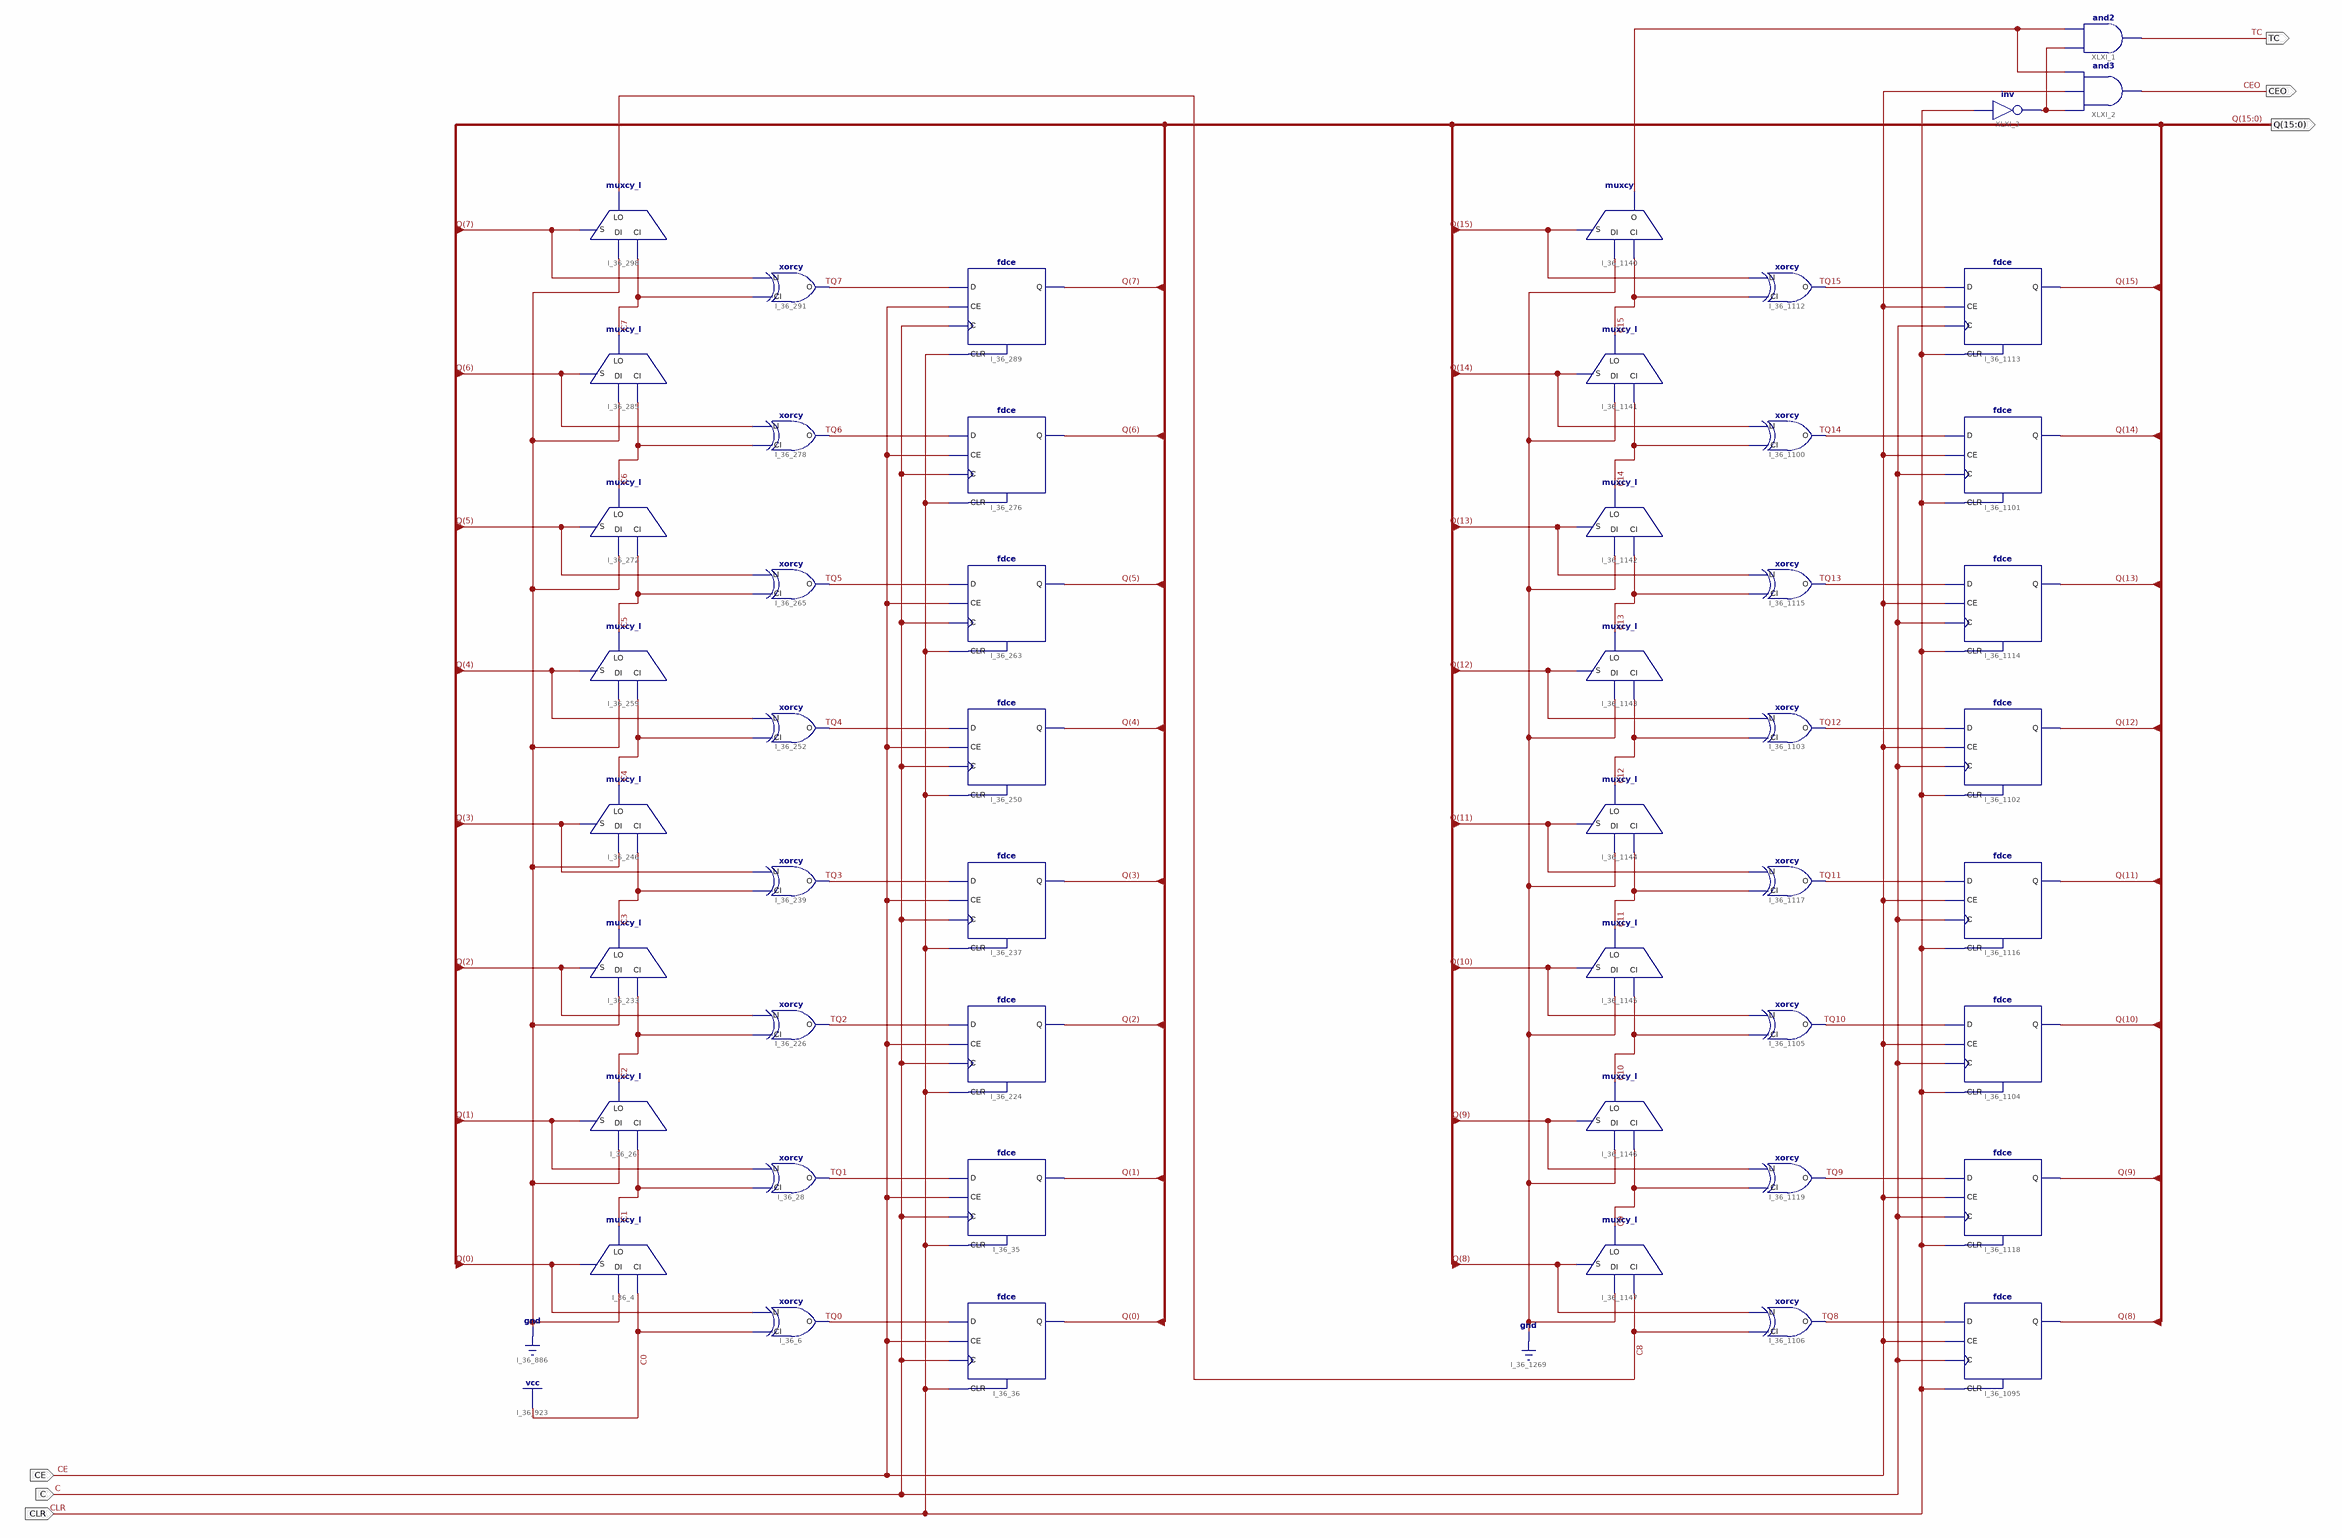
[diagram p0: schematic sheet 1]
// Xilinx ISE schematic Mycc16ce.sch (virtex4) as structural Verilog: 51 symbols, 6 ports
module Mycc16ce (
  input  CE,
  input  CLR,
  input  C,
  output CEO,
  output TC,
  output [15:0] Q
);

  wire C1, C2, C3, C4, C5, C6, C7, C8, C9, C10, C11, C12, C13, C14, C15, TC_1, TQ0, TQ1, TQ2, TQ3, TQ4, TQ5,
       TQ6, TQ7, TQ8, TQ9, TQ10, TQ11, TQ12, TQ13, TQ14, TQ15, XLXN_40;

  fdce #(.RLOC("X0Y2")) I_36_263 (.C(C), .CE(CE), .CLR(CLR), .D(TQ5), .Q(Q[5]));
  fdce #(.RLOC("X0Y0")) I_36_36 (.C(C), .CE(CE), .CLR(CLR), .D(TQ0), .Q(Q[0]));
  fdce #(.RLOC("X0Y0")) I_36_35 (.C(C), .CE(CE), .CLR(CLR), .D(TQ1), .Q(Q[1]));
  fdce #(.RLOC("X0Y7")) I_36_1101 (.C(C), .CE(CE), .CLR(CLR), .D(TQ14), .Q(Q[14]));
  fdce #(.RLOC("X0Y7")) I_36_1113 (.C(C), .CE(CE), .CLR(CLR), .D(TQ15), .Q(Q[15]));
  fdce #(.RLOC("X0Y6")) I_36_1114 (.C(C), .CE(CE), .CLR(CLR), .D(TQ13), .Q(Q[13]));
  fdce #(.RLOC("X0Y6")) I_36_1102 (.C(C), .CE(CE), .CLR(CLR), .D(TQ12), .Q(Q[12]));
  fdce #(.RLOC("X0Y5")) I_36_1116 (.C(C), .CE(CE), .CLR(CLR), .D(TQ11), .Q(Q[11]));
  fdce #(.RLOC("X0Y5")) I_36_1104 (.C(C), .CE(CE), .CLR(CLR), .D(TQ10), .Q(Q[10]));
  fdce #(.RLOC("X0Y4")) I_36_1118 (.C(C), .CE(CE), .CLR(CLR), .D(TQ9), .Q(Q[9]));
  fdce #(.RLOC("X0Y4")) I_36_1095 (.C(C), .CE(CE), .CLR(CLR), .D(TQ8), .Q(Q[8]));
  fdce #(.RLOC("X0Y3")) I_36_289 (.C(C), .CE(CE), .CLR(CLR), .D(TQ7), .Q(Q[7]));
  fdce #(.RLOC("X0Y3")) I_36_276 (.C(C), .CE(CE), .CLR(CLR), .D(TQ6), .Q(Q[6]));
  fdce #(.RLOC("X0Y2")) I_36_250 (.C(C), .CE(CE), .CLR(CLR), .D(TQ4), .Q(Q[4]));
  fdce #(.RLOC("X0Y1")) I_36_237 (.C(C), .CE(CE), .CLR(CLR), .D(TQ3), .Q(Q[3]));
  fdce #(.RLOC("X0Y1")) I_36_224 (.C(C), .CE(CE), .CLR(CLR), .D(TQ2), .Q(Q[2]));
  muxcy_l #(.RLOC("X0Y3")) I_36_285 (.CI(C6), .DI(1'b0), .S(Q[6]), .LO(C7));
  muxcy_l #(.RLOC("X0Y0")) I_36_26 (.CI(C1), .DI(1'b0), .S(Q[1]), .LO(C2));
  muxcy_l #(.RLOC("X0Y0")) I_36_4 (.CI(1'b1), .DI(1'b0), .S(Q[0]), .LO(C1));
  muxcy_l #(.RLOC("X0Y5")) I_36_1144 (.CI(C11), .DI(1'b0), .S(Q[11]), .LO(C12));
  muxcy_l #(.RLOC("X0Y7")) I_36_1141 (.CI(C14), .DI(1'b0), .S(Q[14]), .LO(C15));
  muxcy_l #(.RLOC("X0Y6")) I_36_1142 (.CI(C13), .DI(1'b0), .S(Q[13]), .LO(C14));
  muxcy_l #(.RLOC("X0Y6")) I_36_1143 (.CI(C12), .DI(1'b0), .S(Q[12]), .LO(C13));
  muxcy_l #(.RLOC("X0Y5")) I_36_1145 (.CI(C10), .DI(1'b0), .S(Q[10]), .LO(C11));
  muxcy_l #(.RLOC("X0Y4")) I_36_1146 (.CI(C9), .DI(1'b0), .S(Q[9]), .LO(C10));
  muxcy_l #(.RLOC("X0Y4")) I_36_1147 (.CI(C8), .DI(1'b0), .S(Q[8]), .LO(C9));
  muxcy_l #(.RLOC("X0Y3")) I_36_298 (.CI(C7), .DI(1'b0), .S(Q[7]), .LO(C8));
  muxcy_l #(.RLOC("X0Y2")) I_36_272 (.CI(C5), .DI(1'b0), .S(Q[5]), .LO(C6));
  muxcy_l #(.RLOC("X0Y2")) I_36_259 (.CI(C4), .DI(1'b0), .S(Q[4]), .LO(C5));
  muxcy_l #(.RLOC("X0Y1")) I_36_246 (.CI(C3), .DI(1'b0), .S(Q[3]), .LO(C4));
  muxcy_l #(.RLOC("X0Y1")) I_36_233 (.CI(C2), .DI(1'b0), .S(Q[2]), .LO(C3));
  xorcy #(.RLOC("X0Y0")) I_36_28 (.CI(C1), .LI(Q[1]), .O(TQ1));
  xorcy #(.RLOC("X0Y0")) I_36_6 (.CI(1'b1), .LI(Q[0]), .O(TQ0));
  xorcy #(.RLOC("X0Y3")) I_36_291 (.CI(C7), .LI(Q[7]), .O(TQ7));
  xorcy #(.RLOC("X0Y3")) I_36_278 (.CI(C6), .LI(Q[6]), .O(TQ6));
  xorcy #(.RLOC("X0Y2")) I_36_265 (.CI(C5), .LI(Q[5]), .O(TQ5));
  xorcy #(.RLOC("X0Y2")) I_36_252 (.CI(C4), .LI(Q[4]), .O(TQ4));
  xorcy #(.RLOC("X0Y1")) I_36_239 (.CI(C3), .LI(Q[3]), .O(TQ3));
  xorcy #(.RLOC("X0Y1")) I_36_226 (.CI(C2), .LI(Q[2]), .O(TQ2));
  xorcy #(.RLOC("X0Y7")) I_36_1112 (.CI(C15), .LI(Q[15]), .O(TQ15));
  xorcy #(.RLOC("X0Y7")) I_36_1100 (.CI(C14), .LI(Q[14]), .O(TQ14));
  xorcy #(.RLOC("X0Y6")) I_36_1115 (.CI(C13), .LI(Q[13]), .O(TQ13));
  xorcy #(.RLOC("X0Y6")) I_36_1103 (.CI(C12), .LI(Q[12]), .O(TQ12));
  xorcy #(.RLOC("X0Y5")) I_36_1117 (.CI(C11), .LI(Q[11]), .O(TQ11));
  xorcy #(.RLOC("X0Y5")) I_36_1105 (.CI(C10), .LI(Q[10]), .O(TQ10));
  xorcy #(.RLOC("X0Y4")) I_36_1119 (.CI(C9), .LI(Q[9]), .O(TQ9));
  xorcy #(.RLOC("X0Y4")) I_36_1106 (.CI(C8), .LI(Q[8]), .O(TQ8));
  muxcy #(.RLOC("X0Y7"), .VhdlModel("MUXCY_L"), .VeriModel("MUXCY_L")) I_36_1140 (
    .CI(C15), .DI(1'b0), .S(Q[15]), .O(TC_1));
  and XLXI_1 (TC, XLXN_40, TC_1);
  and XLXI_2 (CEO, XLXN_40, CE, TC_1);
  not XLXI_3 (XLXN_40, CLR);
endmodule
